# Altium project HRR-Hardware.PrjPcb
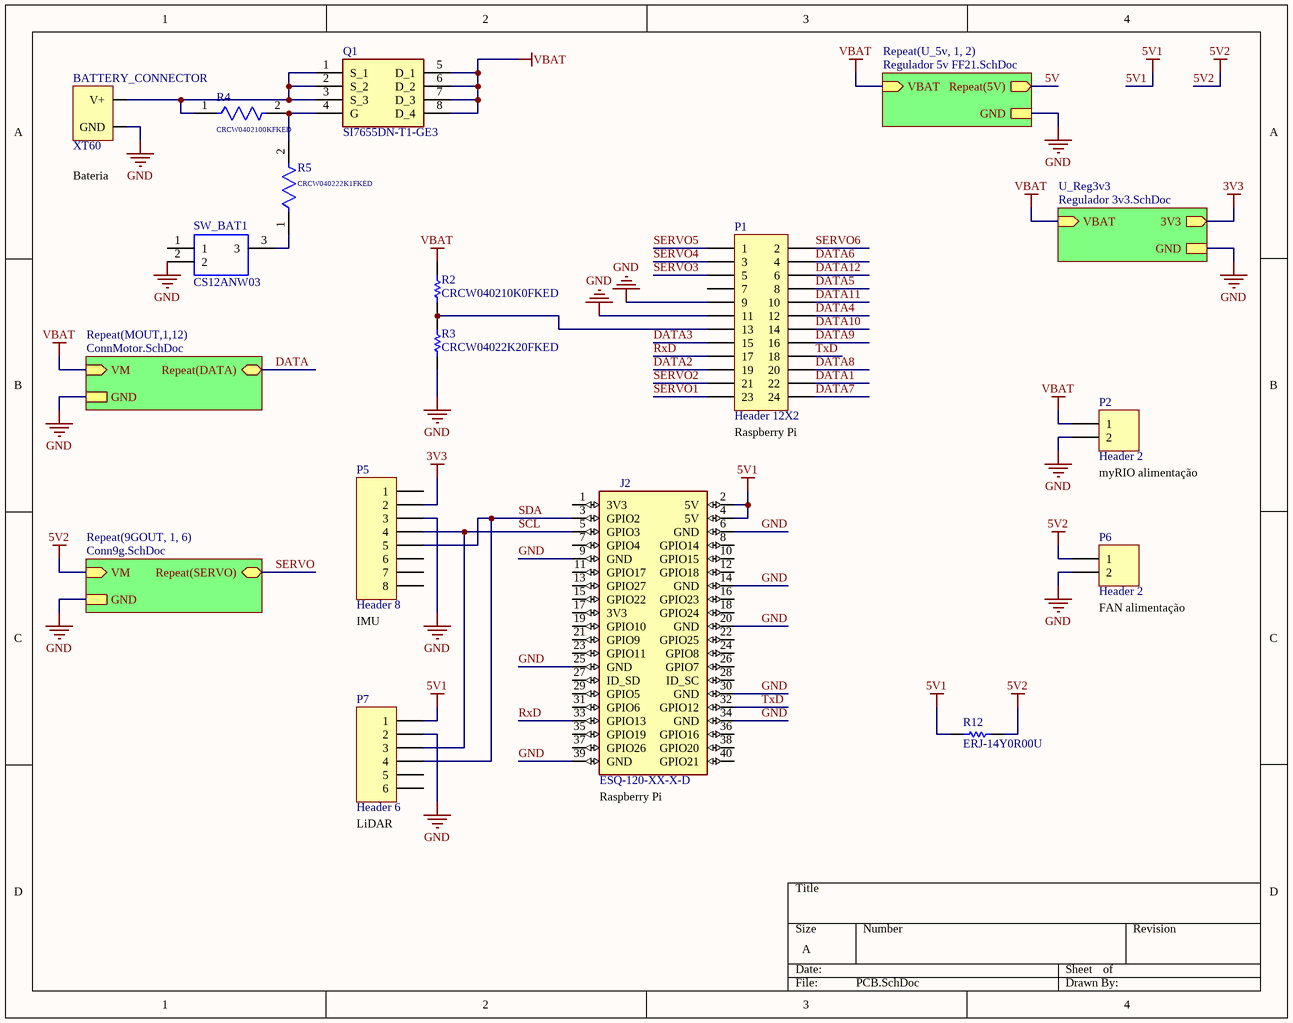
[diagram p0: PCB.SchDoc]
5 sheets, 88 parts. Net scope: hierarchical (ports join the sheet entries above them; power ports are global).
Board file: PCB.PcbDoc
Sheets:
  PCB.SchDoc
    U_5v1 = Regulador 5v FF21.SchDoc
    U_5v2 = Regulador 5v FF21.SchDoc
    U_Reg3v3 = Regulador 3v3.SchDoc
    MOUT1 = ConnMotor.SchDoc
    MOUT2 = ConnMotor.SchDoc
    MOUT3 = ConnMotor.SchDoc
    MOUT4 = ConnMotor.SchDoc
    MOUT5 = ConnMotor.SchDoc
    MOUT6 = ConnMotor.SchDoc
    MOUT7 = ConnMotor.SchDoc
    MOUT8 = ConnMotor.SchDoc
    MOUT9 = ConnMotor.SchDoc
    MOUT10 = ConnMotor.SchDoc
    MOUT11 = ConnMotor.SchDoc
    MOUT12 = ConnMotor.SchDoc
    9GOUT1 = Conn9g.SchDoc
    9GOUT2 = Conn9g.SchDoc
    9GOUT3 = Conn9g.SchDoc
    9GOUT4 = Conn9g.SchDoc
    9GOUT5 = Conn9g.SchDoc
    9GOUT6 = Conn9g.SchDoc

## Sheet PCB.SchDoc
size A

### Parts
BATTERY_CONNECTOR  XT60  [BATTERY_CONECTO-PCB]
J2  ESQ-120-XX-X-D  [ESQ-120-XX-X-D]
P1  Header 12X2  [HDR2X12]
P2  Header 2  [HDR1X2]
P5  Header 8  [HDR1X8]
P6  Header 2  [HDR1X2]
P7  Header 6  [HDR1X6]
Q1  SI7655DN-T1-GE3  [SIS862DNT1GE3]
R2  CRCW040210K0FKED  [RESC1005X40X25NL05T05]
R3  CRCW04022K20FKED  [RESC1005X40X25NL05T05]
R4  CRCW0402100KFKED  [FP-CRCW0402-e3-IPC_A]
R5  CRCW040222K1FKED  [FP-CRCW0402-e3-IPC_A]
R12  ERJ-14Y0R00U  [RESC3225X70X50NL20T20]
SW_BAT1  CS12ANW03  [CS12ANW03]

### Sub-sheets
Repeat(9GOUT, 1, 6) = Conn9g.SchDoc: VM (in), GND, Repeat(SERVO) (bidir)
Repeat(MOUT,1,12) = ConnMotor.SchDoc: GND, VM (in), Repeat(DATA) (bidir)
Repeat(U_5v, 1, 2) = Regulador 5v FF21.SchDoc: Repeat(5V) (out), GND, VBAT (in)
U_Reg3v3 = Regulador 3v3.SchDoc: VBAT (in), 3V3 (out), GND

### Nets
3V3: P5.2 ; sheet U_Reg3v3/3V3
5V1: J2.2(5V) J2.4(5V) P6.1 P7.1 R12.1 R12.2 ; sheet Repeat(9GOUT, 1, 6)/VM  [also labelled 5V2]
GND: BATTERY_CONNECTOR.1(GND) J2.6(GND) J2.9(GND) J2.14(GND) J2.20(GND) J2.25(GND) J2.30(GND) J2.34(GND) J2.39(GND) P1.9 P1.11 P2.2 P5.3 P6.2 P7.2 R3.1 SW_BAT1.2 ; sheet Repeat(U_5v, 1, 2)/GND, sheet U_Reg3v3/GND, sheet Repeat(MOUT,1,12)/GND, sheet Repeat(9GOUT, 1, 6)/GND
VBAT: P2.1 Q1.5(D_1) Q1.6(D_2) Q1.7(D_3) Q1.8(D_4) R2.2 ; sheet Repeat(U_5v, 1, 2)/VBAT, sheet U_Reg3v3/VBAT, sheet Repeat(MOUT,1,12)/VM
5V: sheet Repeat(U_5v, 1, 2)/Repeat(5V)
DATA: sheet Repeat(MOUT,1,12)/Repeat(DATA)
DATA1: P1.22
DATA2: P1.19
DATA3: P1.15
DATA4: P1.12
DATA5: P1.8
DATA6: P1.4
DATA7: P1.24
DATA8: P1.20
DATA9: P1.16
DATA10: P1.14
DATA11: P1.10
DATA12: P1.6
RxD: J2.33(GPIO13) P1.17
SCL: J2.5(GPIO3) P5.4 P7.3
SDA: J2.3(GPIO2) P5.5 P7.4
SERVO: sheet Repeat(9GOUT, 1, 6)/Repeat(SERVO)
SERVO1: P1.23
SERVO2: P1.21
SERVO3: P1.5
SERVO4: P1.3
SERVO5: P1.1
SERVO6: P1.2
TxD: J2.32(GPIO12) P1.18
NetBATTERY_CONNECTOR_0: BATTERY_CONNECTOR.0(V+) Q1.1(S_1) Q1.2(S_2) Q1.3(S_3) R4.1
NetP1_13: P1.13 R2.1 R3.2
NetQ1_4: Q1.4(G) R4.2 R5.2
NetR5_1: R5.1 SW_BAT1.3

Not connected (* = marked no-connect by the designer): J2 1(3V3) 7(GPIO4) 8(GPIO14) 10(GPIO15) 11(GPIO17) 12(GPIO18) 13(GPIO27) 15(GPIO22) 16(GPIO23) 17(3V3) 18(GPIO24) 19(GPIO10) 21(GPIO9) 22(GPIO25) 23(GPIO11) 24(GPIO8) 26(GPIO7) 27(ID_SD) 28(ID_SC) 29(GPIO5) 31(GPIO6) 35(GPIO19) 36(GPIO16) 37(GPIO26) 38(GPIO20) 40(GPIO21); P1 7; P5 1 6 7 8; P7 5 6; SW_BAT1 1

### Notes on the sheet
- (near BATTERY_CONNECTOR) Bateria
- (near P1) Raspberry Pi 4 Model B
- (near P2) myRIO alimentação
- (near P5) IMU
- (near P6) FAN alimentação
- (near P7) LiDAR
- (near J2) Raspberry Pi

### Library data of the parts
BATTERY_CONNECTOR = BATTERY_CONNECTOR: XT60 PRT-10474
J2 = ESQ-120-XX-X-D: ESQ Series .100 PC/104â„¢ Elevated Socket Strip; MP: ESQ-120-38-S-D; MF: Samtec; Digi-Key_Purchase_URL: https://www.digikey.com/product-detail/en/samtec-inc/ESQ-120-38-S-D/ESQ-120-38-S-D-ND/7098755?utm_source=snapeda&utm_medium=aggregator&utm_campaign=symbol; SnapEDA_Link: https://www.snapeda.com/parts/ESQ-120-38-S-D/Samtec%20Inc/view-part/786160/?ref=snap; Digi-Key_Part_Number: ESQ-120-38-S-D-ND; Value: *; Package: None
P1 = Header 12X2: Header, 12-Pin, Dual row; LatestRevisionDate: 17-Jul-2002; LatestRevisionNote: Re-released for DXP Platform.; Publisher: Altium Limited
P2 P6 = Header 2: Header, 2-Pin; LatestRevisionDate: 17-Jul-2002; LatestRevisionNote: Re-released for DXP Platform.; Publisher: Altium Limited
P5 = Header 8: Header, 8-Pin; LatestRevisionDate: 17-Jul-2002; LatestRevisionNote: Re-released for DXP Platform.; Publisher: Altium Limited
P7 = Header 6: Header, 6-Pin; LatestRevisionDate: 17-Jul-2002; LatestRevisionNote: Re-released for DXP Platform.; Publisher: Altium Limited
Q1 = SI7655DN-T1-GE3: MOSFET (P-Channel); Manufacturer_Name: Vishay; Datasheet Link: https://www.vishay.com/docs/63617/si7655dn.pdf; Manufacturer_Part_Number: SI7655DN-T1-GE3; Arrow Part Number: SI7655DN-T1-GE3; Arrow Price/Stock: https://www.arrow.com/en/products/si7655dn-t1-ge3/vishay; Mouser Part Number: 78-SI7655DN-T1-GE3; Mouser Price/Stock: https://www.mouser.com/Search/Refine.aspx?Keyword=78-SI7655DN-T1-GE3
R2 = CMP-2002-08135-1: Manufacturer: Vishay Dale; Part Number: CRCW040210K0FKED
R3 = CMP-2002-08452-1: Manufacturer: Vishay Dale; Part Number: CRCW04022K20FKED
R4 = CMP-2002-08123-3: RES Thick Film, 100kΩ, 1%, 0.063W, 100ppm/°C, 0402; Power Rating: 63mW; Resistance: 100kR; Voltage Rating (DC): 50V; Lead Free: Lead Free; Height: 0.35mm; Contact Plating: Tin; Min Operating Temperature: -55°C; Package Quantity: 10000; Case/Package: 0402; Temperature Coefficient: 100ppm/°C; Number of Terminations: 2; Packaging: Tape and Reel; Max Power Dissipation: 63mW; Case Code (Metric): 1005; Mount: Surface Mount; Width: 0.02inch; Termination: SMD/SMT; Length: 1mm; Number of Pins: 2; Weight: 2.3E-05oz; Radiation Hardening: No; Tolerance: 1%; Military Standard: Not; Features: Automotive AEC-Q200; Depth: 0.5mm; Composition: Thick Film; Max Operating Temperature: 155°C; Voltage Rating: 50V; Case Code (Imperial): 0402
R5 = CMP-2002-08380-2: RES Thick Film, 22.1kΩ, 1%, 0.063W, 100ppm/°C, 0402; Voltage Rating: 50V; Resistance: 22.1kR; Power Rating: 63mW; Length: 1mm; Termination: SMD/SMT; Height: 0.35mm; Package Quantity: 10000; Depth: 0.5mm; Lead Free: Lead Free; Packaging: Tape and Reel; Case/Package: 0402; Max Operating Temperature: 155°C; Composition: Thick Film; Min Operating Temperature: -55°C; Working Voltage: 50V; Number of Pins: 2; Contact Plating: Tin; Mount: Surface Mount; Case Code (Imperial): 0402; Temperature Coefficient: 100ppm/°C; Tolerance: 1%; Voltage Rating (DC): 50V; Width: 0.5mm; Number of Terminations: 2; Radiation Hardening: No; Weight: 2.3E-05oz; Military Standard: Not; Case Code (Metric): 1005
R12 = CMP-2005-03837-1: Manufacturer: Panasonic; Part Number: ERJ-14Y0R00U
SW_BAT1 = CS12ANW03: NKK SWITCHES - CS12ANW03 - SWITCH, SLIDE, SPDT, 3A, 250V, TH; Allied_Number: 70228233; Manufacturer_Name: NKK Switches; Manufacturer_Part_Number: CS12ANW03; RS Part Number: 1251847; RS Price/Stock: http://uk.rs-online.com/web/p/products/1251847; Allied Price/Stock: https://www.alliedelec.com/nkk-switches-cs12anw03/70228233/; Arrow Part Number: CS12ANW03; Arrow Price/Stock: https://www.arrow.com/en/products/cs12anw03/nkk-switches; Datasheet Link: http://www.nkkswitches.com/pdf/cs.pdf

## Sheet Regulador 5v FF21.SchDoc
size A4
Used 2 times, as channels U_5v1, U_5v2. Parts and nets are listed once, with the designators drawn on the sheet.
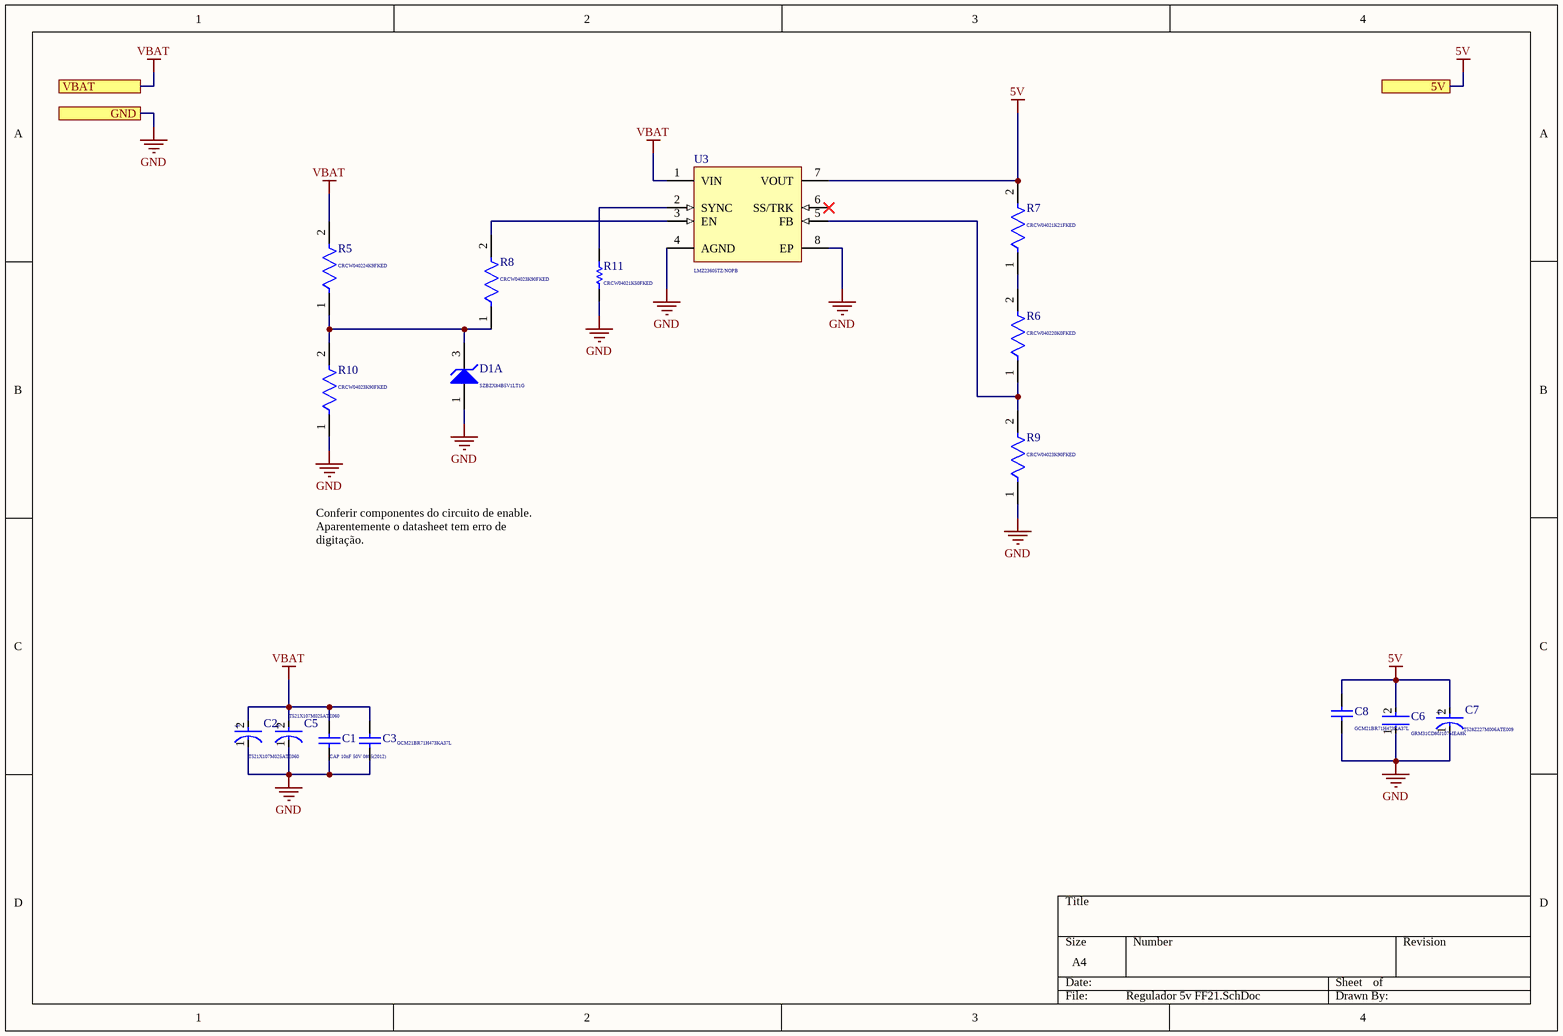
[diagram p1: Regulador 5v FF21.SchDoc]

### Parts
C1  CAP 10nF 50V 0805(2012)  [CAPC0805(2012)75_N]
C2  T521X107M025ATE060  [FP-T521X-MFG]
C3  GCM21BR71H473KA37L  [CAPC2013X140X45ML15T25]
C5  T521X107M025ATE060  [FP-T521X-MFG]
C6  GRM31CD80J107MEA8K  [FP-GRM31C-0_3-e0_3_0_8-IPC_A]
C7  T528Z227M006ATE009  [FP-T528Z227M006ATE009-MFG]
C8  GCM21BR71H473KA37L  [CAPC2013X140X45ML15T25]
D1  SZBZX84B5V1LT1G  [ONSC-SOT-23-3-318-08_V]  (part A of 2)
R5  CRCW040224K9FKED  [FP-CRCW0402-e3-IPC_C]
R6  CRCW040220K0FKED  [FP-CRCW0402-e3-IPC_B]
R7  CRCW04021K21FKED  [FP-CRCW0402-e3-IPC_B]
R8  CRCW04023K90FKED  [FP-CRCW0402-e3-MFG]
R9  CRCW04023K90FKED  [FP-CRCW0402-e3-MFG]
R10  CRCW04023K90FKED  [FP-CRCW0402-e3-MFG]
R11  CRCW04021K50FKED  [RESC1005X40X25NL05T05]
U3  LMZ23605TZ/NOPB  [NDW0007A_V]

### Ports
5V, GND, VBAT

### Nets
5V: C6.2 C7.2(A) C8.2 R7.2 U3.7(VOUT) ; port 5V
GND: C1.1 C2.1(C) C3.1 C5.1(C) C6.1 C7.1(C) C8.1 D1.1(A) R9.1 R10.1 R11.1 U3.4(AGND) U3.8(EP) ; port GND
VBAT: C1.2 C2.2(A) C3.2 C5.2(A) R5.2 U3.1(VIN) ; port VBAT
NetD1_3: D1.3(K) R5.1 R8.1 R10.2
NetR6_1: R6.1 R9.2 U3.5(FB)
NetR6_2: R6.2 R7.1
NetR8_2: R8.2 U3.3(EN)
NetR11_2: R11.2 U3.2(SYNC)

Not connected (* = marked no-connect by the designer): U3 6(SS/TRK)*

### Channels
U_5v1: designators end in _U_5v1; ports 5V=5V1 GND=GND VBAT=VBAT
U_5v2: designators end in _U_5v2; ports 5V=5V1 GND=GND VBAT=VBAT

### Notes on the sheet
- Conferir componentes do circuito de enable. Aparentemente o datasheet tem erro de digitação.
- (in symbol CMP-03017-000004-1) +
- (in symbol CMP-03017-000006-1) +

### Library data of the parts
C1 = CMP-1036-03839-1: CAP 10nF 50V ±5% 0805 (2012 Metric) Thickness 0.75mm SMD; Case-Metric: 2012; Case-EIA: 0805; Tolerance: Â±5%; Technology: SMT; Max Thickness: 0.75 mm; Rated Voltage: 50 V; Value: 10nF
C2 C5 = CMP-03017-000004-1: CAP TANT POLY 100UF 25V 2917; Polarity: Polar; Tolerance: 20%; Life (Hours): 2000Hour; ESR (Equivalent Series Resistance): 60mR; Dissipation Factor: 10%; Voltage Rating (DC): 25V; Features: General Purpose; Length: 7.3mm; Case/Package: 2917; Max Operating Temperature: 105°C; Construction: Flat; Capacitance: 100uF; Min Operating Temperature: -55°C; Package Quantity: 1; RoHS Compliant: Yes; Height: 4mm; Depth: 4.3mm; REACH SVHC: No SVHC; Termination: SMD/SMT; Width: 4.3mm; Case Code (Metric): 7343; Height - Seated (Max): 0.169inch; Case Code (Imperial): 2917; Radiation Hardening: No; Voltage Rating: 25V; Mount: Surface Mount; Packaging: Tape and Reel; Series: KO-CAP T521
C3 C8 = CMP-2007-03359-1: Manufacturer: Murata; Part Number: GCM21BR71H473KA37L
C6 = CMP-06035-046129-1: Chip Multilayer Ceramic Capacitors for General Purpose, 1206, 100uF, X6T, +22%/-33%, 20%, 6.3V
C7 = CMP-03017-000006-1: CAP TANT POLY 220UF 6.3V 2917; Tolerance: 20%; Dissipation Factor: 10%; ESR (Equivalent Series Resistance): 9mR; Ripple Current: 6A; Leakage Current: 138.6uA; Polarity: Polar; Mount: Surface Mount; Termination: SMD/SMT; Features: General Purpose; Case Code (Imperial): 2917; Min Operating Temperature: -55°C; Height - Seated (Max): 0.067inch; Depth: 4.3mm; Package Quantity: 1; Voltage Rating (DC): 6.3V; Max Operating Temperature: 105°C; Capacitance: 220uF; Packaging: Tape and Reel; Voltage Rating: 6.3V; Case/Package: 2917; Construction: Flat; REACH SVHC: No SVHC; Width: 4.3mm; RoHS Compliant: Yes; Height: 1.7mm; Case Code (Metric): 7343; Length: 7.3mm; Series: KO-CAP T528
D1 = CMP-1060-00895-1: Zener Voltage Regulator, 225 mW, 3-Pin SOT-23, Pb-Free, Tape and Reel; Manufacturer: On Semiconductor; VZ Typ (V): 5.1; ComponentLink3URL: http://www.onsemi.cn/pub_link/Collateral/318-08.PDF; ComponentLink2Description: Datasheet; PackageVersion: Rev. AP, 11/2009; ComponentLink3Description: Package Specification; PartNumber: SZBZX84B5V1LT1G; DatasheetVersion: Rev. 17; RoHS: Pb-Free; Mounting Technology: Surface Mount; ComponentLink2URL: http://www.onsemi.com/pub_link/Collateral/BZX84C2V4LT1-D.PDF; PackageDescription: 3-Pin Small Outline Transistor, Body 2.92 x 1.3 mm, Pitch 0.95 mm; ComponentLink1Description: Manufacturer URL; PackageReference: SOT-23-3-318-08; ComponentLink1URL: http://www.onsemi.com/; Packing: Tape and Reel
R5 = CMP-2002-08407-2: RES Thick Film, 24.9kΩ, 1%, 0.063W, 100ppm/°C, 0402; Voltage Rating (DC): 50V; Resistance: 24.9kR; Power Rating: 63mW; Temperature Coefficient: 100ppm/°C; Case/Package: 0402; Length: 1mm; Radiation Hardening: No; Case Code (Imperial): 0402; Lead Free: Lead Free; Military Standard: Not; Composition: Thick Film; Tolerance: 1%; Min Operating Temperature: -55°C; Height: 0.35mm; Mount: Surface Mount; Max Operating Temperature: 155°C; Packaging: Tape and Reel; Case Code (Metric): 1005; Number of Terminations: 2; Contact Plating: Tin; Voltage Rating: 50V; Weight: 2.3E-05oz; Termination: SMD/SMT; Width: 0.5mm; Max Power Dissipation: 63mW; Number of Pins: 2; Features: Automotive AEC-Q200; Depth: 0.5mm; Package Quantity: 10
R6 = CMP-2002-08356-2: RES Thick Film, 20kΩ, 1%, 0.063W, 100ppm/°C, 0402; Max Power Dissipation: 63mW; Working Voltage: 50V; Resistance: 20kR; Contact Plating: Tin; Packaging: Tape and Reel; Height: 0.35mm; Case Code (Imperial): 0402; Tolerance: 1%; Width: 0.5mm; Composition: Thick Film; Mount: Surface Mount; Termination: SMD/SMT; Number of Pins: 2; Number of Terminations: 2; Length: 1mm; Temperature Coefficient: 100ppm/°C; Case Code (Metric): 1005; Voltage Rating: 50V; Lead Free: Lead Free; Voltage Rating (DC): 50V; Min Operating Temperature: -55°C; Max Operating Temperature: 155°C; Package Quantity: 10; Radiation Hardening: No; Weight: 2.3E-05oz; Military Standard: Not; Case/Package: 0402; Power Rating: 63mW; Depth: 0.5mm; Features: Automotive AEC-Q200
R7 = CMP-2002-08286-2: RES Thick Film, 1.21kΩ, 1%, 0.063W, 100ppm/°C, 0402; Power Rating: 63mW; Resistance: 1.21kR; Voltage Rating (DC): 50V; Case/Package: 0402; Number of Terminations: 2; Height: 0.35mm; Width: 0.02inch; Temperature Coefficient: 100ppm/°C; Number of Pins: 2; Military Standard: Not; Contact Plating: Tin; Tolerance: 1%; Length: 1mm; Features: Automotive AEC-Q200; Composition: Thick Film; Lead Free: Lead Free; Radiation Hardening: No; Min Operating Temperature: -55°C; Weight: 2.3E-05oz; Case Code (Metric): 1005; Max Power Dissipation: 63mW; Packaging: Tape and Reel; Max Operating Temperature: 155°C; Termination: SMD/SMT; Voltage Rating: 50V; Package Quantity: 10; Depth: 0.5mm; Case Code (Imperial): 0402
R8-R10 = CMP-2002-08592-2: RES Thick Film, 3.9kΩ, 1%, 0.063W, 100ppm/°C, 0402; Max Power Dissipation: 63mW; Working Voltage: 50V; Resistance: 3.9kR; Lead Free: Lead Free; Case Code (Metric): 1005; Number of Terminations: 2; Tolerance: 1%; Features: Automotive AEC-Q200; Width: 0.5mm; Case/Package: 0402; Height: 0.35mm; Case Code (Imperial): 0402; Contact Plating: Tin; Weight: 2.3E-05oz; Temperature Coefficient: 100ppm/°C; Max Operating Temperature: 155°C; Termination: SMD/SMT; Voltage Rating (DC): 50V; Package Quantity: 10; Power Rating: 63mW; Voltage Rating: 50V; Length: 1mm; Military Standard: Not; Depth: 0.5mm; Composition: Thick Film; Min Operating Temperature: -55°C; Radiation Hardening: No; Packaging: Tape and Reel
R11 = CMP-2002-08297-1: Manufacturer: Vishay Dale; Part Number: CRCW04021K50FKED
U3 = CMP-0069-02058-2: 5A SIMPLE SWITCHER® Power Module with 36V Maximum Input Voltage, 7 pin TO-PMOD, 45 Rail; Manufacturer: Texas Instruments; PackageTopMarking: NSUZXYTTE#*LMZ23605; PowerWise: N; PinCount: 7; ComponentLink1URL: http://www.ti.com/general/docs/lit/getliterature.tsp?genericPartNumber=LMZ23605&fileType=pdf; PackageDescription: TO-PMOD-7, 10.16 x 9.85 x 4.57 mm Body, 7 Lead, 1.27mm Pitch, Surface Mount; CompType: Switcher; ComponentLink1Description: Datasheet URL; RoHS: Y; PackageReference: NDW0007A

## Sheet Regulador 3v3.SchDoc
size A
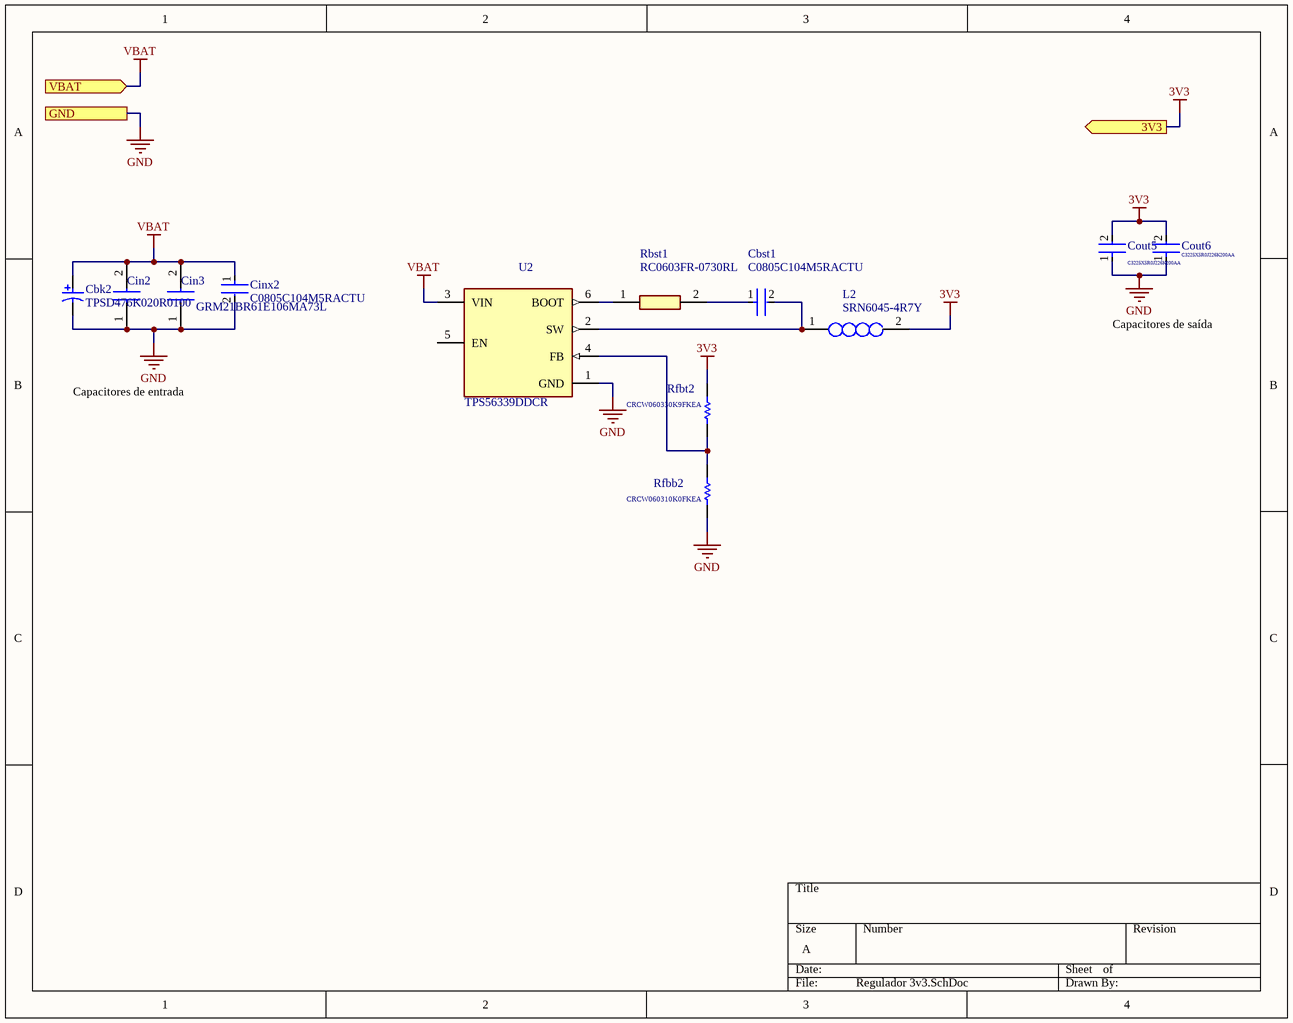
[diagram p2: Regulador 3v3.SchDoc]

### Parts
Cbk2  TPSD476K020R0100  [TPSD476K020R0100]
Cbst1  C0805C104M5RACTU  [FP-C0805C-DN-MFG]
Cin2  GRM21BR61E106MA73L  [CAPC2012X145N]  (value not drawn)
Cin3  GRM21BR61E106MA73L  [CAPC2012X145N]
Cinx2  C0805C104M5RACTU  [FP-C0805C-DN-MFG]
Cout5  C3225X5R0J226K200AA  [FP-C3225-200-0_4-IPC_C]
Cout6  C3225X5R0J226K200AA  [FP-C3225-200-0_4-IPC_C]
L2  SRN6045-4R7Y  [SRN6045_1]
Rbst1  RC0603FR-0730RL  [RESC1608X55N]
Rfbb2  CRCW060310K0FKEA  [RESC1609X50X30NL8T20]
Rfbt2  CRCW060330K9FKEA  [RESC1609X50X30LL10T20]
U2  TPS56339DDCR  [FP-DDC0006A-MFG]

### Ports
3V3 (out), GND, VBAT (in)

### Nets
3V3: Cout5.2 Cout6.2 L2.2 Rfbt2.2 ; port 3V3
GND: Cbk2.2 Cin2.1 Cin3.1 Cinx2.2 Cout5.1 Cout6.1 Rfbb2.2 U2.1(GND) ; port GND
VBAT: Cbk2.1 Cin2.2 Cin3.2 Cinx2.1 U2.3(VIN) ; port VBAT
NetCbst1_1: Cbst1.1 Rbst1.2
NetCbst1_2: Cbst1.2 L2.1 U2.2(SW)
NetRbst1_1: Rbst1.1 U2.6(BOOT)
NetRfbb2_1: Rfbb2.1 Rfbt2.1 U2.4(FB)

Not connected (* = marked no-connect by the designer): U2 5(EN)

### Notes on the sheet
- Capacitores de saída
- Capacitores de entrada

### Library data of the parts
Cbk2 = TPSD476K020R0100: CAP TANT 47UF 20V 10% 2917; Manufacturer: Kyocera AVX; Dielectric Material: Tantalum; ESR (Equivalent Series Resistance): 100mR; Leakage Current: 9.4uA; Polarity: Polar; Dissipation Factor: 6%; Ripple Current: 490uA; Supplier 1: Arrow Electronics; Manufacturer Part Number: TPSD476K020R0100; RoHS: Yes; Category: Tantalum Capacitors; Stock 1: 2; Pricing 1: 1=1.88550, 10=1.55250, 25=1.53920, 50=1.52390, 100=1.08810, 1000=1.02300 (USD); Mount: Surface Mount; Case/Package: 2917; Weight: 0.023634oz; Case Code (Imperial): 2917; Case Code (Metric): 7343; Min Operating Temperature: -55°C; Max Operating Temperature: 125°C; Capacitance: 47uF; Tolerance: 10%; Termination: SMD/SMT; Voltage: 20V; Features: General Purpose; Packaging: Tape and Reel; Voltage Rating: 20V; Package Quantity: 1; Length: 7.3mm; Height: 2.9mm; Depth: 4.3mm; Height - Seated (Max): 0.122inch; Width: 4.3mm; Radiation Hardening: No; REACH SVHC: No SVHC; Lead Free: Lead Free; ComponentLink1URL: https://datasheet.ciiva.com/11794/0900766b80962b61-11794592.pdf?src-supplier=RSComponents; ComponentLink1Description: https://datasheet.ciiva.com/11794/0900766b80962b61-11794592.pdf?src-supplier=RSComponents; ComponentLink2URL: https://datasheet.ciiva.com/39121/1154520-39121511.pdf?src-supplier=Jameco; ComponentLink2Description: https://datasheet.ciiva.com/39121/1154520-39121511.pdf?src-supplier=Jameco; ComponentLink3URL: https://datasheet.ciiva.com/26787/tpsd476k020r0100-26787068.pdf?src-supplier=IIIC; ComponentLink3Description: https://datasheet.ciiva.com/26787/tpsd476k020r0100-26787068.pdf?src-supplier=IIIC; ComponentLink4URL: https://datasheet.ciiva.com/7713/1680477-7713477.pdf?src-supplier=Element14; ComponentLink4Description: https://datasheet.ciiva.com/7713/1680477-7713477.pdf?src-supplier=Element14; ComponentLink5URL: https://datasheet.ciiva.com/7713/1680477-7713478.pdf?src-supplier=Element14; ComponentLink5Description: https://datasheet.ciiva.com/7713/1680477-7713478.pdf?src-supplier=Element14; ComponentLink6URL: https://datasheet.ciiva.com/16632/tps-16632569.pdf?src-supplier=Avnet+Europe; ComponentLink6Description: https://datasheet.ciiva.com/16632/tps-16632569.pdf?src-supplier=Avnet+Europe; ComponentLink7URL: https://datasheet.ciiva.com/12910/tps-23028-12910555.pdf?src-supplier=Mouser; ComponentLink7Description: https://datasheet.ciiva.com/12910/tps-23028-12910555.pdf?src-supplier=Mouser; ComponentLink8URL: https://datasheet.ciiva.com/11232/tps-11232172.pdf?src-supplier=Avnet; ComponentLink8Description: https://datasheet.ciiva.com/11232/tps-11232172.pdf?src-supplier=Avnet; ComponentLink9URL: https://datasheet.ciiva.com/265/tps-265005.pdf?src-supplier=Digi-Key; ComponentLink9Description: https://datasheet.ciiva.com/265/tps-265005.pdf?src-supplier=Digi-Key; ComponentLink10URL: https://datasheet.ciiva.com/265/tps-265006.pdf?src-supplier=Digi-Key; ComponentLink10Description: https://datasheet.ciiva.com/265/tps-265006.pdf?src-supplier=Digi-Key; ComponentLink11URL: https://datasheet.ciiva.com/265/tps-265007.pdf?src-supplier=Digi-Key; ComponentLink11Description: https://datasheet.ciiva.com/265/tps-265007.pdf?src-supplier=Digi-Key
Cbst1 Cinx2 = CMP-03020-020207-1: CAP CER 0.1UF 50V X7R 0805; Manufacturer: KEMET; Tolerance: 0.2; Temperature Coefficient: 30ppm/°C; Capacitance: 0.10 μF; Value: 0.10 μF; Temperature: -55°C to +125°C; RoHS: TRUE; Temperature Range Low: -55°C; Device Class L3: Ceramic Capacitors; Manufacturer Part Number: C0805C104M5RACTU; Octopart: https://octopart.com/c0805c104m5ractu-kemet-129379; Ipc Land Pattern Name: CAPC200125X78; Mouser Description: Multilayer Ceramic Capacitors MLCC - SMD/SMT 50volts 0.1uF X7R 20%; Temperature Range High: +125°C; Material: Ceramic; Package: C0805C-DN; Temperature Characteristic: X7R; Automotive: No; ComponentLink2URL: https://content.kemet.com/datasheets/KEM_C1003_C0G_SMD.pdf; Device Class L1: Passive Components; ComponentLink2Description: Datasheet; Device Class L2: Capacitors; Voltage Rating: 50 V; Digikey Description: CAP CER 0.1UF 50V X7R 0805; Lead Free: Yes; Height: 0.88mm; Category: Cap
Cin2 Cin3 = GRM21BR61E106MA73L: Capacitor; Manufacturer_Name: Murata Electronics; Datasheet Link: https://componentsearchengine.com//GRM21BR61E106MA73L.pdf; Height: 1.45mm; Mouser2 Part Number: 81-GRM21BR61E106MA3L; Mouser2 Price/Stock: https://www.mouser.com/Search/Refine.aspx?Keyword=81-GRM21BR61E106MA3L; Manufacturer_Part_Number: GRM21BR61E106MA73L
Cout5 Cout6 = CMP-08246-003519-1: Multilayer Ceramic Capacitors 22uF ±10% 6.3V X5R SMD 1210; Case Code (Imperial): 1210; RoHS Compliant: Yes; Series: C; Number of Pins: 2; Depth: 2.5mm; Package Quantity: 1000; Length: 3.2mm; Termination: SMD/SMT; Capacitance: 22uF; Weight: 0.000564oz; Packaging: Tape and Reel; Dielectric Material: Ceramic; Min Operating Temperature: -55°C; Voltage Rating: 6.3V; Resistor Type: Ceramic; Case/Package: 1210; Voltage: 6.3V; Dielectric: X5R; Max Operating Temperature: 85°C; Tolerance: 10%; Thickness: 0.087inch; Case Code (Metric): 3225; Lead Free: Lead Free; Height: 2.5mm; Voltage Rating (DC): 6.3V; Mount: Surface Mount; Width: 0.098inch
L2 = SRN6045-4R7Y: Inductor; Manufacturer_Name: Bourns; Datasheet Link: https://www.bourns.com/data/global/pdfs/SRN6045.pdf; Manufacturer_Part_Number: SRN6045-4R7Y
Rbst1 = RC0603FR-0730RL: Resistor; Manufacturer_Name: YAGEO (PHYCOMP); Datasheet Link: http://www.yageo.com/documents/recent/PYu-RC0603_51_RoHS_L_v5.pdf; Height: 0.55mm; Manufacturer_Part_Number: RC0603FR-0730RL
Rfbb2 = CMP-1666-00005-4: Chip Resistor, 10 KOhm, +/- 1%, 100 mW, -55 to 155 degC, 0603 (1608 Metric), RoHS, Tape and Reel; Manufacturer: Vishay Semiconductor; Voltage Rating: 75 V; Max Operating Temperature: 155 degC; PackageDescription: 2-Pin Surface Mount Device, Body 1.575 x 0.85 mm; ComponentLink1Description: Manufacturer URL; RoHSCompliant: true; PackageReference: 0603; REACH SVHC: Unknown; Length: 1.55 mm; DatasheetVersion: 06/2012; Packaging: Tape and Reel; Min Operating Temperature: -55 degC; Mounting Technology: Surface Mount; ComponentLink2URL: https://datasheet.ciiva.com/11809/0900766b80d98afc-11809037.pdf; Height: 0.45 mm; ComponentLink2Description: Datasheet; Package Quantity: 5000; ComponentLink1URL: http://www.vishay.com/
Rfbt2 = CMP-2000-03227-1: Manufacturer: Vishay Dale; Part Number: CRCW060330K9FKEA
U2 = CMP-04918-000012-1: PWR MGMT SPECIALIZED REGULATOR; Manufacturer: Texas Instruments; Output Type: AdjustableProgrammable; Max Supply Voltage: 24V; Min Supply Voltage: 4.5V; Nominal Supply Current: 98uA; Max Duty Cycle: 97%; Number Of Outputs: 1; Output Current: 3A; Switching Topology: Buck; Standoff Height: 0mm; Switching Frequency: 500kHz; Output Voltage: 0.8-16V; Max Junction Temp: +125°C; ComponentLink2Description: Datasheet; ComponentLink2URL: http://www.ti.com/lit/ds/symlink/tps56339.pdf; Package: DDC0006A; RoHS: TRUE; Temperature: -40°C to +125°C; Temperature Range Low: -40°C; Device Class L3: Voltage Regulators - Switching; Temperature Range High: +125°C; Device Class L2: Power Management ICs; Device Class L1: Integrated Circuits (ICs); Category: IC; Manufacturer Part Number: TPS56339DDCR; Octopart: https://octopart.com/tps56339ddcr-texas+instruments-101466410; Automotive: No; Height: 1.1mm; Digikey Description: PWR MGMT SPECIALIZED REGULATOR; Lead Free: Yes; Mouser Description: 4.5-V to 24-V input, 3-A output synchronous buck converter 6-SOT-23-THIN -40 to 125

## Sheet ConnMotor.SchDoc
size A
Used 12 times, as channels MOUT1, MOUT2, MOUT3, MOUT4, MOUT5, MOUT6, MOUT7, MOUT8, MOUT9, MOUT10, MOUT11, MOUT12. Parts and nets are listed once, with the designators drawn on the sheet.
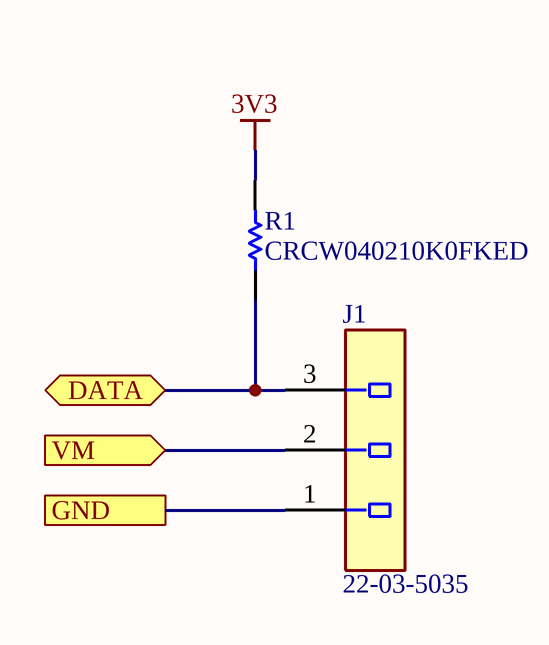
[diagram p3: ConnMotor.SchDoc]

### Parts
J1  Part Number: 22-03-5035  [Molex_22-03-5035_0]  (hidden comment: Conn_Molex_22-03-5035_eec)
R1  CRCW040210K0FKED  [RESC1005X40X25NL05T05]

### Ports
DATA (bidir), GND, VM (in)

### Nets
3V3: R1.2
DATA: J1.3 R1.1 ; port DATA
GND: J1.1 ; port GND
VM: J1.2 ; port VM

### Channels
MOUT1: designators end in _MOUT1; ports DATA=DATA1 GND=GND VM=VBAT
MOUT2: designators end in _MOUT2; ports DATA=DATA2 GND=GND VM=VBAT
MOUT3: designators end in _MOUT3; ports DATA=DATA3 GND=GND VM=VBAT
MOUT4: designators end in _MOUT4; ports DATA=DATA4 GND=GND VM=VBAT
MOUT5: designators end in _MOUT5; ports DATA=DATA5 GND=GND VM=VBAT
MOUT6: designators end in _MOUT6; ports DATA=DATA6 GND=GND VM=VBAT
MOUT7: designators end in _MOUT7; ports DATA=DATA7 GND=GND VM=VBAT
MOUT8: designators end in _MOUT8; ports DATA=DATA8 GND=GND VM=VBAT
MOUT9: designators end in _MOUT9; ports DATA=DATA9 GND=GND VM=VBAT
MOUT10: designators end in _MOUT10; ports DATA=DATA10 GND=GND VM=VBAT
MOUT11: designators end in _MOUT11; ports DATA=DATA11 GND=GND VM=VBAT
MOUT12: designators end in _MOUT12; ports DATA=DATA12 GND=GND VM=VBAT

### Library data of the parts
J1 = Conn_Molex_22-03-5035_eec: CONN 3 Positions Header Connector 0.098" (2.50mm) Through Hole Tin; Manufacturer: Molex; Num Pins: 3; Category E7012A0Bd22E3Cc6: Headers & Receptacles; pin_pitch: 2.5mm; shrouded: Yes; glow_wire_compliant: Non-Compliant; size_length: 9.9mm; contact_material: Brass; voltage_rating_ac: 250V; number_of_rows: 1; Category 75Fab8F04590Ae3D: Connectors and Adapters; contact_resistance: 20mΩ; size_width: 4.9mm; gender: Female; current_rating: 3A; size_height: 5.9mm; insulation_resistance: 1GΩ; Category 0836C53C3D42D3F1: Connectors; helpURL: https://upverter.com/upn/revision/5f4eec58f2a5589a/; ComponentLink2Description: Datasheet; Temperature: -40°C to +105°C; Package: CONN_PTH_HDR3; Supplier 2: Mouser; Price: 0.362417304973; Supplier 1: Digi-Key; ComponentLink1URL: https://upverter.com/upn/revision/5f4eec58f2a5589a/; Supplier Part Number 2: 538-22-03-5035; Supplier Part Number 1: WM18887-ND; ComponentLink1Description: Upverter; ComponentLink2URL: http://www.molex.com/pdm_docs/sd/022035035_sd.pdf; RoHS: TRUE; Mouser Part Number: 538-22-03-5035; orientation: Vertical; number_of_circuits: 3; lifecycle_status: Active; Temperature Range High: +105°C; number_of_contacts: 3; Temperature Range Low: -40°C; Digikey Part Number: WM18887-ND; contact_plating: Tin; voltage_rating_dc: 250V; Lead Free: yes; flammability_rating: UL 94 V-0; halogen_free_status: Not Low Halogen; Digikey Description: CONN 3 Positions Header Connector 0.098" (2.50mm) Through Hole Tin; number_of_positions: 3; Mounting Type: pcb; Octopart Part Number: 2021e92f3fb6ffe6
R1 = CMP-2002-08135-1: Manufacturer: Vishay Dale; Part Number: CRCW040210K0FKED

## Sheet Conn9g.SchDoc
size A
Used 6 times, as channels 9GOUT1, 9GOUT2, 9GOUT3, 9GOUT4, 9GOUT5, 9GOUT6. Parts and nets are listed once, with the designators drawn on the sheet.
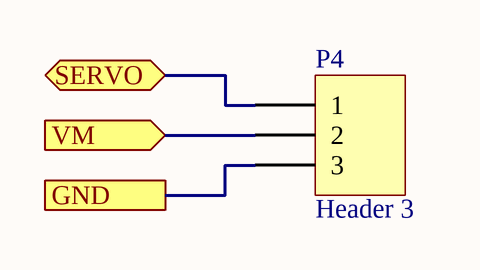
[diagram p4: Conn9g.SchDoc]

### Parts
P4  Header 3  [HDR1X3]

### Ports
GND, SERVO (bidir), VM (in)

### Nets
GND: P4.3 ; port GND
SERVO: P4.1 ; port SERVO
VM: P4.2 ; port VM

### Channels
9GOUT1: designators end in _9GOUT1; ports GND=GND SERVO=SERVO1 VM=5V1
9GOUT2: designators end in _9GOUT2; ports GND=GND SERVO=SERVO2 VM=5V1
9GOUT3: designators end in _9GOUT3; ports GND=GND SERVO=SERVO3 VM=5V1
9GOUT4: designators end in _9GOUT4; ports GND=GND SERVO=SERVO4 VM=5V1
9GOUT5: designators end in _9GOUT5; ports GND=GND SERVO=SERVO5 VM=5V1
9GOUT6: designators end in _9GOUT6; ports GND=GND SERVO=SERVO6 VM=5V1

### Library data of the parts
P4 = Header 3: Header, 3-Pin; LatestRevisionDate: 17-Jul-2002; LatestRevisionNote: Re-released for DXP Platform.; Publisher: Altium Limited

## Nets that join several sheets
3V3: PCB (P5.2), Regulador 3v3 (Cout5.2 Cout6.2 L2.2 Rfbt2.2), MOUT1 (R1_MOUT1.2), MOUT2 (R1_MOUT2.2), MOUT3 (R1_MOUT3.2), MOUT4 (R1_MOUT4.2), MOUT5 (R1_MOUT5.2), MOUT6 (R1_MOUT6.2), MOUT7 (R1_MOUT7.2), MOUT8 (R1_MOUT8.2), MOUT9 (R1_MOUT9.2), MOUT10 (R1_MOUT10.2), MOUT11 (R1_MOUT11.2), MOUT12 (R1_MOUT12.2)
5V1: PCB (6 pins), U_5v1 (5 pins), U_5v2 (5 pins), 9GOUT1 (P4_9GOUT1.2), 9GOUT2 (P4_9GOUT2.2), 9GOUT3 (P4_9GOUT3.2), 9GOUT4 (P4_9GOUT4.2), 9GOUT5 (P4_9GOUT5.2), 9GOUT6 (P4_9GOUT6.2)
GND: PCB (17 pins), U_5v1 (13 pins), U_5v2 (13 pins), Regulador 3v3 (8 pins), MOUT1 (J1_MOUT1.1), MOUT2 (J1_MOUT2.1), MOUT3 (J1_MOUT3.1), MOUT4 (J1_MOUT4.1), MOUT5 (J1_MOUT5.1), MOUT6 (J1_MOUT6.1), MOUT7 (J1_MOUT7.1), MOUT8 (J1_MOUT8.1), MOUT9 (J1_MOUT9.1), MOUT10 (J1_MOUT10.1), MOUT11 (J1_MOUT11.1), MOUT12 (J1_MOUT12.1), 9GOUT1 (P4_9GOUT1.3), 9GOUT2 (P4_9GOUT2.3), 9GOUT3 (P4_9GOUT3.3), 9GOUT4 (P4_9GOUT4.3), 9GOUT5 (P4_9GOUT5.3), 9GOUT6 (P4_9GOUT6.3)
VBAT: PCB (6 pins), U_5v1 (6 pins), U_5v2 (6 pins), Regulador 3v3 (5 pins), MOUT1 (J1_MOUT1.2), MOUT2 (J1_MOUT2.2), MOUT3 (J1_MOUT3.2), MOUT4 (J1_MOUT4.2), MOUT5 (J1_MOUT5.2), MOUT6 (J1_MOUT6.2), MOUT7 (J1_MOUT7.2), MOUT8 (J1_MOUT8.2), MOUT9 (J1_MOUT9.2), MOUT10 (J1_MOUT10.2), MOUT11 (J1_MOUT11.2), MOUT12 (J1_MOUT12.2)
DATA1: PCB (P1.22), MOUT1 (J1_MOUT1.3 R1_MOUT1.1)
DATA2: PCB (P1.19), MOUT2 (J1_MOUT2.3 R1_MOUT2.1)
DATA3: PCB (P1.15), MOUT3 (J1_MOUT3.3 R1_MOUT3.1)
DATA4: PCB (P1.12), MOUT4 (J1_MOUT4.3 R1_MOUT4.1)
DATA5: PCB (P1.8), MOUT5 (J1_MOUT5.3 R1_MOUT5.1)
DATA6: PCB (P1.4), MOUT6 (J1_MOUT6.3 R1_MOUT6.1)
DATA7: PCB (P1.24), MOUT7 (J1_MOUT7.3 R1_MOUT7.1)
DATA8: PCB (P1.20), MOUT8 (J1_MOUT8.3 R1_MOUT8.1)
DATA9: PCB (P1.16), MOUT9 (J1_MOUT9.3 R1_MOUT9.1)
DATA10: PCB (P1.14), MOUT10 (J1_MOUT10.3 R1_MOUT10.1)
DATA11: PCB (P1.10), MOUT11 (J1_MOUT11.3 R1_MOUT11.1)
DATA12: PCB (P1.6), MOUT12 (J1_MOUT12.3 R1_MOUT12.1)
SERVO1: PCB (P1.23), 9GOUT1 (P4_9GOUT1.1)
SERVO2: PCB (P1.21), 9GOUT2 (P4_9GOUT2.1)
SERVO3: PCB (P1.5), 9GOUT3 (P4_9GOUT3.1)
SERVO4: PCB (P1.3), 9GOUT4 (P4_9GOUT4.1)
SERVO5: PCB (P1.1), 9GOUT5 (P4_9GOUT5.1)
SERVO6: PCB (P1.2), 9GOUT6 (P4_9GOUT6.1)